# Altium schematic sheet FP_Connectors.SchDoc: =DocumentName
size A4; SPICEModelCache: <root> / <DocumentId>EZLIUZWI</DocumentId> / <CacheFrame Number="0"> / <Model Name="0603_155060gs75300" Kind="CKT"> / <Text>******** / .subckt 0603_155060GS75300 1 2 / D1 1 2 SMSW / .MODEL SMSW D / + IS=695.94E-6 / + N=5 / + RS=2.4677 / + IKF=16.109E-12 / + CJO=1.0000E-12 / + M=.3333 / + VJ=.75 / + BV=5 / + IBV=10.00E-6 / + TT=5.0000E-9 / .ends</Text> / </Model> / </CacheFrame> / </root>; DocumentNumber: 1; Revision: 0; SheetNumber: 6; SheetTotal: 15; Last modified by: Krzysztof Belewicz
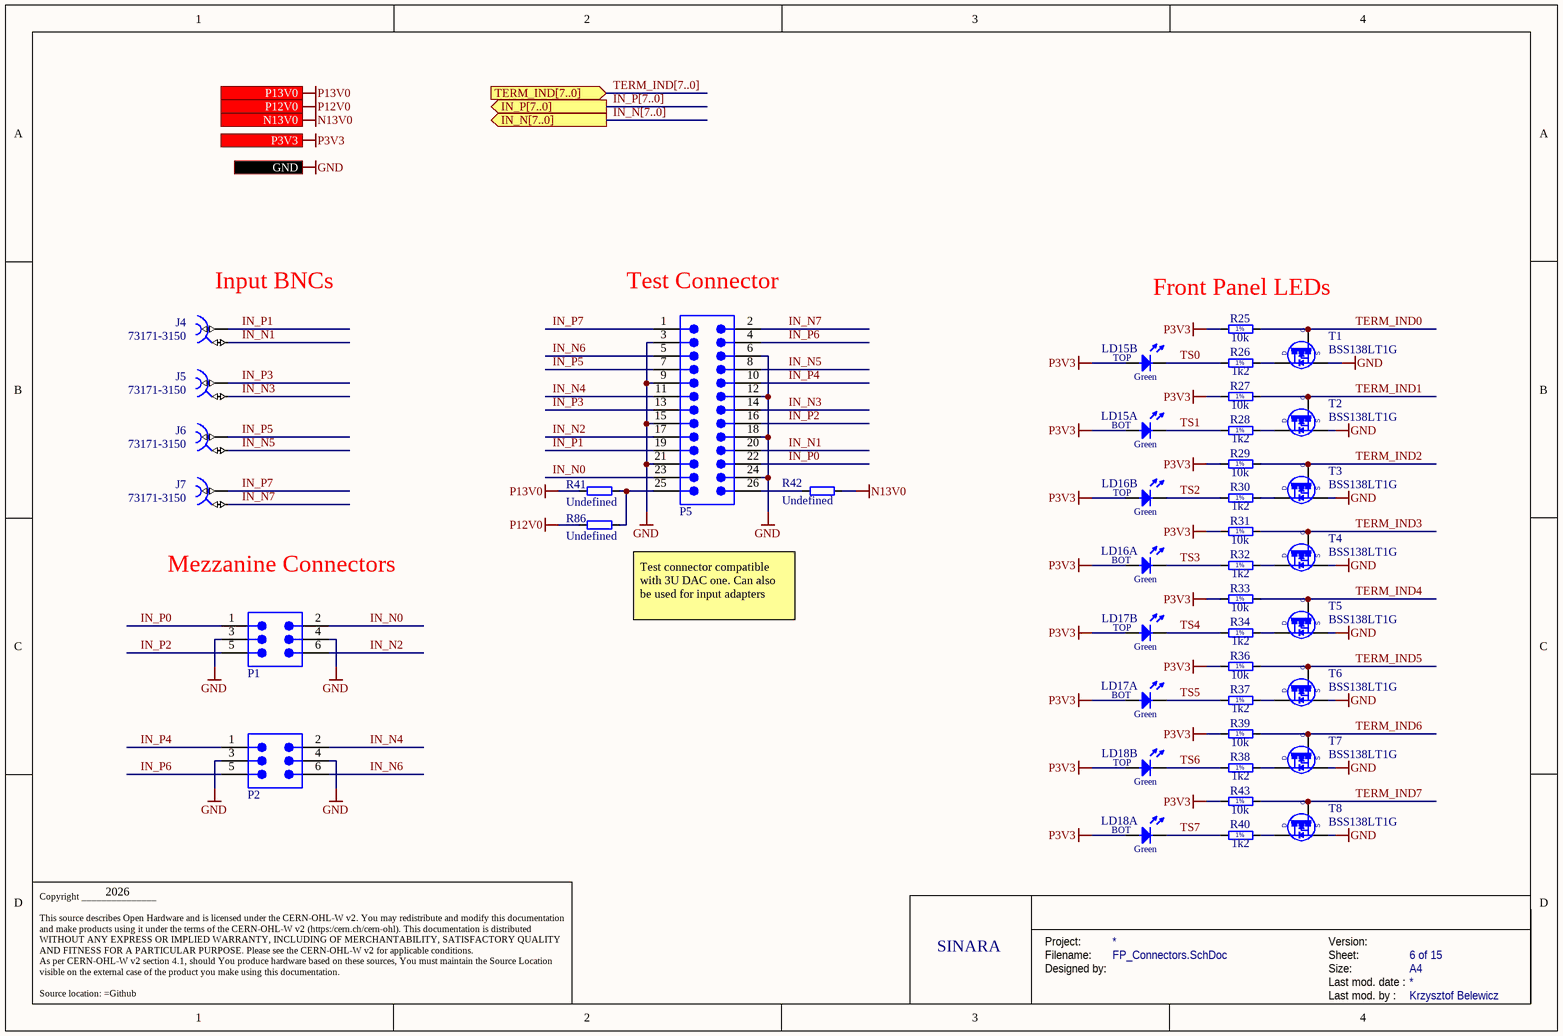
[diagram p0: FP_Connectors.SchDoc]

## Parts
J4  73171-3150  [MOLEX_73171-3150]
J5  73171-3150  [MOLEX_73171-3150]
J6  73171-3150  [MOLEX_73171-3150]
J7  73171-3150  [MOLEX_73171-3150]
LD15  Green/Green  [LED_DIALIGHT_571-0122F]  (value not drawn)  (parts A,B of 2)
LD16  Green/Green  [LED_DIALIGHT_571-0122F]  (value not drawn)  (parts A,B of 2)
LD17  Green/Green  [LED_DIALIGHT_571-0122F]  (value not drawn)  (parts A,B of 2)
LD18  Green/Green  [LED_DIALIGHT_571-0122F]  (value not drawn)  (parts A,B of 2)
P1  61300621121  [61300621121]  (value not drawn)
P2  61300621121  [61300621121]  (value not drawn)
P5  61302621121  [61302621121]  (value not drawn)
R25  10k  [RESC1005X40N]
R26  1k2  [RESC1608X55N]
R27  10k  [RESC1005X40N]
R28  1k2  [RESC1608X55N]
R29  10k  [RESC1005X40N]
R30  1k2  [RESC1608X55N]
R31  10k  [RESC1005X40N]
R32  1k2  [RESC1608X55N]
R33  10k  [RESC1005X40N]
R34  1k2  [RESC1608X55N]
R36  10k  [RESC1005X40N]
R37  1k2  [RESC1608X55N]
R38  1k2  [RESC1608X55N]
R39  10k  [RESC1005X40N]
R40  1k2  [RESC1608X55N]
R41  Undefined  [RESC1608X55N]
R42  Undefined  [RESC1608X55N]
R43  10k  [RESC1005X40N]
R86  Undefined  [RESC1608X55N]
T1  BSS138LT1G  [SOT95P240X110-3N]
T2  BSS138LT1G  [SOT95P240X110-3N]
T3  BSS138LT1G  [SOT95P240X110-3N]
T4  BSS138LT1G  [SOT95P240X110-3N]
T5  BSS138LT1G  [SOT95P240X110-3N]
T6  BSS138LT1G  [SOT95P240X110-3N]
T7  BSS138LT1G  [SOT95P240X110-3N]
T8  BSS138LT1G  [SOT95P240X110-3N]

## Ports
GND, IN_N[7..0] (out), IN_P[7..0] (out), N13V0 (in), P3V3 (in), P12V0 (in), P13V0 (in), TERM_IND[7..0] (in)

## Nets
GND: P1.3 P1.4 P2.3 P2.4 P5.3 P5.6 P5.9 P5.12 P5.15 P5.18 P5.21 P5.24 T1.2(S) T2.2(S) T3.2(S) T4.2(S) T5.2(S) T6.2(S) T7.2(S) T8.2(S) ; port GND
N13V0: R42.2 ; port N13V0
P3V3: LD15.2(A) LD15.4(A) LD16.2(A) LD16.4(A) LD17.2(A) LD17.4(A) LD18.2(A) LD18.4(A) R25.1 R27.1 R29.1 R31.1 R33.1 R36.1 R39.1 R43.1 ; port P3V3
P12V0: R86.2 ; port P12V0
P13V0: R41.2 ; port P13V0
IN_N0: P1.2 P5.23
IN_N1: J4.2 P5.20
IN_N2: P1.6 P5.17
IN_N3: J5.2 P5.14
IN_N4: P2.2 P5.11
IN_N5: J6.2 P5.8
IN_N6: P2.6 P5.5
IN_N7: J7.2 P5.2
IN_P0: P1.1 P5.22
IN_P1: J4.1 P5.19
IN_P2: P1.5 P5.16
IN_P3: J5.1 P5.13
IN_P4: P2.1 P5.10
IN_P5: J6.1 P5.7
IN_P6: P2.5 P5.4
IN_P7: J7.1 P5.1
TERM_IND0: R25.2 T1.1(G)
TERM_IND1: R27.2 T2.1(G)
TERM_IND2: R29.2 T3.1(G)
TERM_IND3: R31.2 T4.1(G)
TERM_IND4: R33.2 T5.1(G)
TERM_IND5: R36.2 T6.1(G)
TERM_IND6: R39.2 T7.1(G)
TERM_IND7: R43.2 T8.1(G)
TS0: LD15.3(C) R26.1
TS1: LD15.1(C) R28.1
TS2: LD16.3(C) R30.1
TS3: LD16.1(C) R32.1
TS4: LD17.3(C) R34.1
TS5: LD17.1(C) R37.1
TS6: LD18.3(C) R38.1
TS7: LD18.1(C) R40.1
NetP5_25: P5.25 R41.1 R86.1
NetP5_26: P5.26 R42.1
NetR26_2: R26.2 T1.3(D)
NetR28_2: R28.2 T2.3(D)
NetR30_2: R30.2 T3.3(D)
NetR32_2: R32.2 T4.3(D)
NetR34_2: R34.2 T5.3(D)
NetR37_2: R37.2 T6.3(D)
NetR38_2: R38.2 T7.3(D)
NetR40_2: R40.2 T8.3(D)

## Buses and harness runs
bus IN_N[7..0] = port IN_N[7..0]
bus IN_P[7..0] = port IN_P[7..0]
bus TERM_IND[7..0] = port TERM_IND[7..0]

## Notes on the sheet
- (near J4) Input BNCs
- (near P5) Test Connector
- Front Panel LEDs
- Mezzanine Connectors
- (near R86) Test connector compatible with 3U DAC one. Can also be used for input adapters
- 2026
- SINARA
- Project:
- Designed by:
- Filename:
- Size:
- Version:
- Last mod. date :
- Sheet:
- A4
- Copyright _______________
  This source describes Open Hardware and is licensed under the CERN-OHL-W v2. You may redistribute and modify this documentation and make products using it under the terms of the CERN-OHL-W v2 (https:/cern.ch/cern-ohl). This documentation is distributed WITHOUT ANY EXPRESS OR IMPLIED WARRANTY, INCLUDING OF MERCHANTABILITY, SATISFACTORY QUALITY AND FITNESS FOR A PARTICULAR PURPOSE. Please see the CERN-OHL-W v2 for applicable conditions.
  As per CERN-OHL-W v2 section 4.1, should You produce hardware based on these sources, You must maintain the Source Location visible on the external case of the product you make using this documentation.
  Source location: =Github
- Last mod. by :
- (in symbol LED_DIALIGHT_571-0122F, part A) BOT; Green
- (in symbol LED_DIALIGHT_571-0122F, part B) TOP; Green
- (in symbol R0402_10K_1%_0.0625W_100PPM) 1%
- (in symbol R0603_1K2_1%_0.1W_100PPM) 1%

## Library data of the parts
J4-J7 = MOLEX_73171-3150: RF Connectors / Coaxial Connectors BNC RA PCB RECPT 50 OHM; Manufacturer: MOLEX; Manufacturer Part Number: 73251-3150; PressFit: No; Part Number: 73171-3150; Component Kind: Standard; Component Type: Standard; Pin Count: 3; Family: BNC; Mounted: Yes; Socket: No; SMD: No; Sense: No; Status: None; Part Description: RF Connectors / Coaxial Connectors BNC RA PCB RECPT 50 OHM; HelpURL: https://www.molex.com/en-us/products/part-detail/731713150?display=pdf; CreateDate: 31.01.2025; LatestRevisionDate: 31.01.2025
LD15-LD18 = LED_DIALIGHT_571-0122F: LED x2 Green 1C2A-BOT_3C4A-TOP; Part Description: Dual 2mm Green LEDs CBI® Circuit Board Indicator (Without positioning pins); PressFit: No; Bonding: No; Part Number: LED_DIALIGHT_571-0122F; Component Kind: Standard; Component Type: Standard; Color: Green/Green; PackageDescription: 2x 2mm Red LED PCB Edge Mounting (Without positioning pins) DIALIGHT 571 Serie; Manufacturer: DIALIGHT; Manufacturer Part Number: 571-0122F; Pin Count: 4; Mounted: Yes; Socket: No; SMD: No; Sense: No; ComponentHeight: 8.6mm; HelpURL: \\cern.ch\dfs\Applications\Altium\Datasheets\LED_DIALIGHT_571-0122F.pdf; Author: CERN DEM JLC; CreateDate: 09/11/2009; LatestRevisionDate: 17/03/2010
P1 P2 = 61300621121: WR-PHD Pin Header, THT, Vertical, pitch 2.54mm, 2 Row, 6P; Manufacturer: Wurth Elektronik; Contact Resistance: 20mOhm; Rated Current: 3A; Working Voltage: 250V; Withstanding Voltage: 500V; Manufacturer Part Number: 61300621121; Category: Board-to-Board Connectors; Match Code: WR-PHD; ComponentLink1Description: Website Link; ComponentLink1URL: https://www.we-online.com/redexpert/article/61300621121?ad; ComponentLink2Description: Datasheet Link; ComponentLink2URL: https://www.we-online.com/redexpert/spec/61300621121?ad; Mount: Through Hole; Operating Temperature Max: 105°C; Operating Temperature Min: -40°C; Packaging: Bag; Gender: Pin Header; Number of Pins: 6; Number of Rows: 2; Orientation: Vertical; Pitch: 2.54mm
P5 = 61302621121: WR-PHD Pin Header, THT, Vertical, pitch 2.54mm, 2 Row, 26P; Manufacturer: Wurth Elektronik; Contact Resistance: 20mOhm; Rated Current: 3A; Working Voltage: 250V; Withstanding Voltage: 500V; Manufacturer Part Number: 61302621121; Category: Board-to-Board Connectors; Match Code: WR-PHD; ComponentLink1Description: Website Link; ComponentLink1URL: https://www.we-online.com/redexpert/article/61302621121?ad; ComponentLink2Description: Datasheet Link; ComponentLink2URL: https://www.we-online.com/redexpert/spec/61302621121?ad; Mount: Through Hole; Operating Temperature Max: 105°C; Operating Temperature Min: -40°C; Packaging: Bag; Gender: Pin Header; Number of Pins: 26; Number of Rows: 2; Orientation: Vertical; Pitch: 2.54mm
R25 R27 R29 R31 R33 R36 R39 R43 = R0402_10K_1%_0.0625W_100PPM: Resistor - 1%; Part Description: General Purpose Thick Film Chip Resistor; Manufacturer: GENERIC; Manufacturer1 Part Number: 232270671003L; TC: ±100ppm/°C; Part Number: R0402_10K_1%_0.0625W_100PPM; Component Kind: Standard; Component Type: Standard; Pin Count: 2; Value: 10k; Status: Not recommended; Power: 0.0625W; Tolerance: ±1%; Manufacturer Part Number: R0402_10K_1%_0.0625W_100PPM; Case: 0402; Mounted: Yes; Sense: No; Socket: No; SMD: Yes; Manufacturer1 Example: YAGEO PHYCOMP; Manufacturer1 ComponentHeight: 0.4mm; HelpURL: \\cern.ch\dfs\Applications\Altium\Datasheets\R0402_Phycomp_RC0402.pdf; Author: CERN DEM JLC; CreateDate: 03.12.2007; LatestRevisionDate: 17.10.2012
R26 R28 R30 R32 R34 R37 R38 R40 = R0603_1K2_1%_0.1W_100PPM: Resistor - 1%; Part Description: General Purpose Thick Film Chip Resistor; Manufacturer: GENERIC; Manufacturer1 Part Number: NRC06F1201TRF; Power: 0.1W; TC: ±100ppm/°C; Part Number: R0603_1K2_1%_0.1W_100PPM; Component Kind: Standard; Component Type: Standard; Pin Count: 2; Value: 1k2; Status: Preferred; Tolerance: ±1%; Manufacturer Part Number: R0603_1K2_1%_0.1W_100PPM; Case: 0603; Mounted: Yes; Sense: No; Socket: No; SMD: Yes; Manufacturer1 Example: NIC COMPONENT; Manufacturer1 ComponentHeight: 0.55mm; HelpURL: \\cern.ch\dfs\Applications\Altium\Datasheets\R0603_NIC_NRC.pdf; Author: CERN DEM JLC; CreateDate: 03.12.2007; LatestRevisionDate: 13.03.2008
R41 R42 R86 = R0603_NO-VALUE: Resistor; Part Description: Reserved Footprint For a 0603 (1608) Chip Resistor; Mounted: No; Part Number: R0603_NO-VALUE; Component Kind: Standard; Component Type: Standard; Pin Count: 2; Value: Undefined; Status: None; Manufacturer: Undefined; Manufacturer Part Number: R0603_NO-VALUE; Case: 0603; Sense: No; Socket: No; SMD: Yes; Manufacturer1 Example: Undefined; Manufacturer1 Part Number: Undefined; Manufacturer1 ComponentHeight: Undefined; HelpURL: Undefined; Author: CERN DEM JLC; CreateDate: 03.12.2007; LatestRevisionDate: 13.03.2008
T1-T8 = BSS138LT1G: N-CHANNEL MOSFET WITH DIODE; Part Description: 50V 200mA N-Channel Enhancement Mode Field-Effect Transistor; Manufacturer: ON SEMICONDUCTOR; PressFit: No; Bonding: No; Part Number: BSS138LT1G; Component Kind: Standard; Component Type: Standard; Device: BSS138LT1G; PackageDescription: SOT23 3-Leads, Pitch 0.95mm - Body 1.4x3mm, IPC Medium Density; Manufacturer Part Number: BSS138LT1G; Pin Count: 3; Case: SOT23-3; Mounted: Yes; Socket: No; SMD: Yes; Sense: No; ComponentHeight: 1.11mm; HelpURL: \\cern.ch\dfs\Applications\Altium\Datasheets\BSS138LT1G.pdf; Author: CERN DEM JLC; CreateDate: 23.03.2009; LatestRevisionDate: 23.03.2009